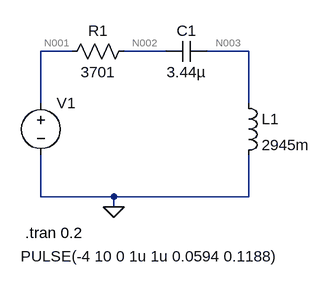
[diagram p0: schematic LC.asc]
LC.asc, the LTspice schematic file:
Version 4
SHEET 1 880 680
WIRE -64 -112 -112 -112
WIRE 80 -112 16 -112
WIRE 208 -112 144 -112
WIRE -112 -32 -112 -112
WIRE 208 -32 208 -112
WIRE -112 112 -112 48
WIRE 0 112 -112 112
WIRE 208 112 208 48
WIRE 208 112 0 112
WIRE 0 128 0 112
FLAG 0 128 0
SYMBOL voltage -112 -48 R0
WINDOW 123 0 0 Left 0
WINDOW 39 0 0 Left 0
WINDOW 3 -31 252 Left 2
SYMATTR Value PULSE(-4 10 0 1u 1u 0.0594 0.1188)
SYMATTR InstName V1
SYMBOL res 32 -128 R90
WINDOW 0 0 56 VBottom 2
WINDOW 3 32 56 VTop 2
SYMATTR InstName R1
SYMATTR Value 3701
SYMBOL ind 192 -48 R0
SYMATTR InstName L1
SYMATTR Value 2945m
SYMATTR SpiceLine Rser=24
SYMBOL cap 80 -96 R270
WINDOW 0 32 32 VTop 2
WINDOW 3 0 32 VBottom 2
SYMATTR InstName C1
SYMATTR Value 3.44µ
TEXT -136 168 Left 2 !.tran 0.2

The netlist it stands for:
* LC.asc
V1 N001 0 PULSE(-4 10 0 1u 1u 0.0594 0.1188)
R1 N002 N001 3701
L1 N003 0 2945m Rser=24
C1 N002 N003 3.44µ
.tran 0.2
.backanno
.end

* Results of the author's LTspice run, read from the files saved beside the schematic
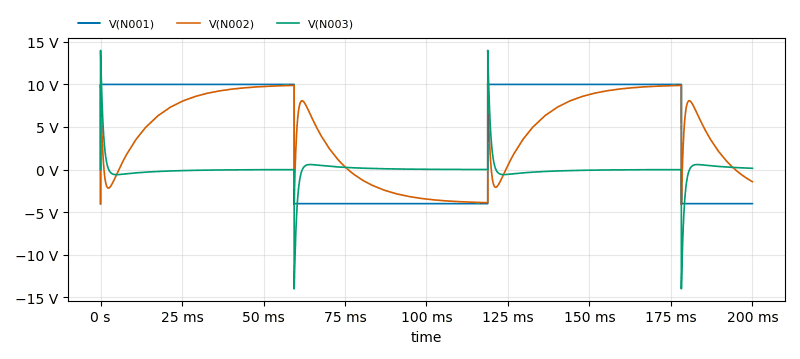
[diagram p1: Transient Analysis of LC.asc, plotted from the saved traces]
* Transient Analysis, 1 run:
*   V(N001): min -4 V, max 10 V, average 4.316 V, rms 8.118 V, last -4 V
*   V(N002): min -4.103 V, max 10.1 V, average 4.158 V, rms 6.488 V, last -1.425 V
*   V(N003): min -14 V, max 14 V, average -9.521 mV, rms 1.262 V, last 154.5 mV